# EAGLE schematic String Thing 1.0 (EAGLE 6.1)
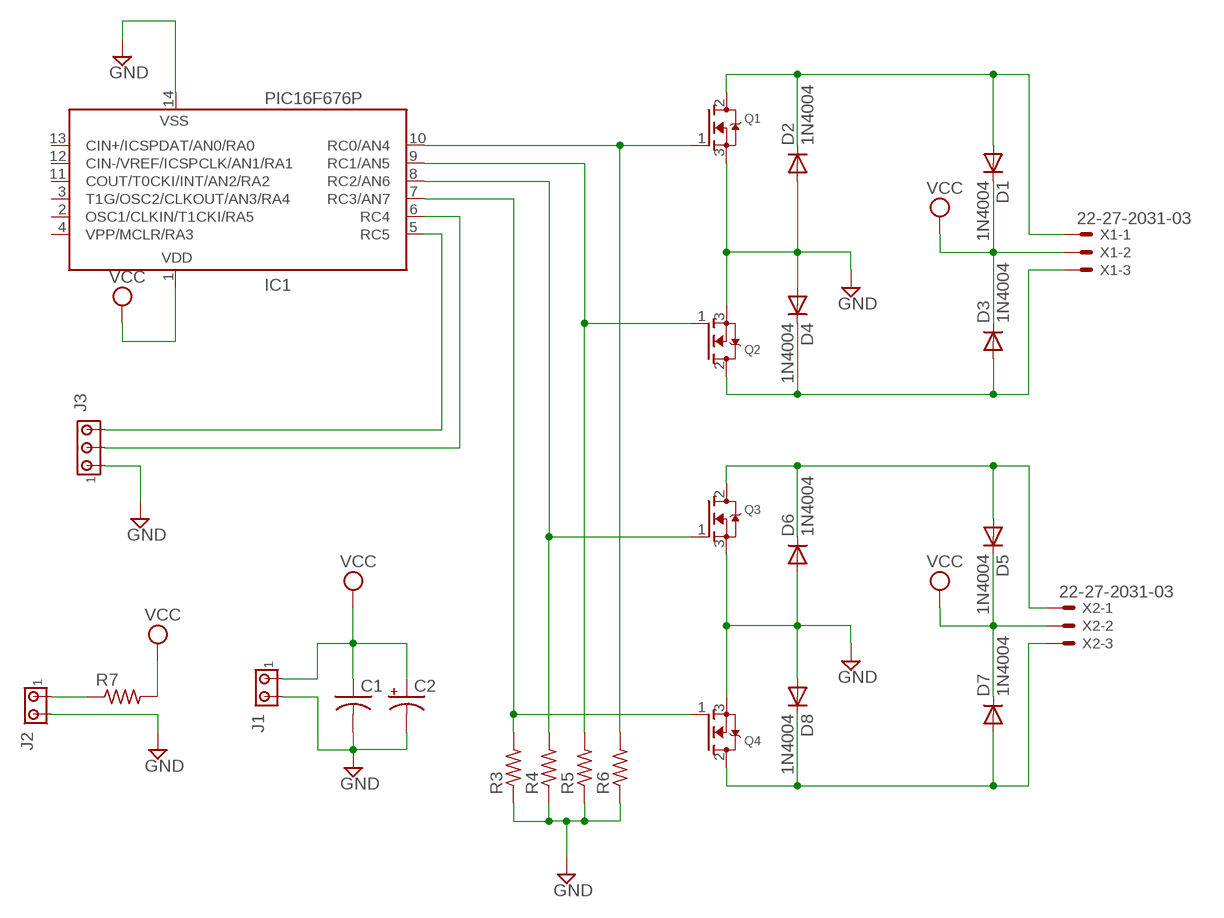
[diagram p0: schematic, sheet 1]

## Parts
C1  C-US025-025X050  [C025-025X050]
C2  CPOL-USE2.5-5  [E2,5-5]
D1  1N4004  [DO41-10]
D2  1N4004  [DO41-10]
D3  1N4004  [DO41-10]
D4  1N4004  [DO41-10]
D5  1N4004  [DO41-10]
D6  1N4004  [DO41-10]
D7  1N4004  [DO41-10]
D8  1N4004  [DO41-10]
IC1  PIC16F676P  [DIL14]
J1  MTA02-100  [10X02MTA]
J2  MTA02-100  [10X02MTA]
J3  MTA03-100  [10X03MTA]
Q1  MOSFET-NGDS_TO220V  [TO220V]
Q2  MOSFET-NGDS_TO220V  [TO220V]
Q3  MOSFET-NGDS_TO220V  [TO220V]
Q4  MOSFET-NGDS_TO220V  [TO220V]
R3  R-US_0207/10  [0207/10]
R4  R-US_0207/10  [0207/10]
R5  R-US_0207/10  [0207/10]
R6  R-US_0207/10  [0207/10]
R7  R-US_0207/10  [0207/10]
X1  22-27-2031-03  [6410-03]
X2  22-27-2031-03  [6410-03]

## Nets
GND: C1.2 C2.- D2.A D4.A D6.A D8.A IC1.14(VSS) J1.2 J2.2 J3.1 Q1.3(S) Q2.3(S) Q3.3(S) Q4.3(S) R3.1 R4.1 R5.1 R6.1
N$1: IC1.7(RC3/AN7) Q4.1(G) R3.2
N$2: IC1.8(RC2/AN6) Q3.1(G) R4.2
N$3: IC1.9(RC1/AN5) Q2.1(G) R5.2
N$4: IC1.10(RC0/AN4) Q1.1(G) R6.2
N$5: D1.A D2.C Q1.2(D) X1.1
N$6: D3.A D4.C Q2.2(D) X1.3
N$7: D5.A D6.C Q3.2(D) X2.1
N$8: D7.A D8.C Q4.2(D) X2.3
N$9: J2.1 R7.1
N$10: IC1.5(RC5) J3.3
N$11: IC1.6(RC4) J3.2
VCC: C1.1 C2.+ D1.C D3.C D5.C D7.C IC1.1(VDD) J1.1 R7.2 X1.2 X2.2
Unconnected: IC1.2(OSC1/CLKIN/T1CKI/RA5) IC1.3(T1G/OSC2/CLKOUT/AN3/RA4) IC1.4(VPP/MCLR/RA3) IC1.11(COUT/T0CKI/INT/AN2/RA2) IC1.12(CIN-/VREF/ICSPCLK/AN1/RA1) IC1.13(CIN+/ICSPDAT/AN0/RA0)

## Library data of the parts
C1 = adafruit:C-US: CAPACITOR, American symbol
C2 = adafruit:CPOL-US: POLARIZED CAPACITOR, American symbol
D1-D8 = diode:1N4004: DIODE general purpose rectifier, 1 A
IC1 = microchip:PIC16F676: 14-Pin, Flash-Based 8-Bit CMOS Microcontroller High Performance RISC CPU: * Only 35 instructions to learn - All single-cycle instructions except branches * Operating speed: - DC - 20 MHz oscillator/clock input - DC - 200 ns instruction cycle * Internal and external oscillator options - Precision Internal 4 MHz oscillator factory calibrated to ±1% - External Oscillator support for crystals and resonators - 5?s wake-up from SLEEP, 3.0V, typical * Power saving SLEEP mode * Wide operating voltage range - 2.0V to 5.5V * Industrial and Extended temperature range * Low power Power-on Reset (POR) * Power-up Timer (PWRT) and Oscillator Start-up Timer (OST) * Brown-out Detect (BOD) * Watchdog Timer (WDT) with independent oscillator for reliable operation * Multiplexed MCLR/Input-pin * Interrupt-on-pin change * Individual programmable weak pull-ups * Programmable code protection * High Endurance FLASH/EEPROM Cell - 100,000 write FLASH endurance - 1,000,000 write EEPROM endurance - FLASH/Data EEPROM Retention: > 40 years * Standby Current: - 1 nA @ 2.0V, typical * Operating Current: - 8.5?A @ 32 kHz, 2.0V, typical - 100?A @ 1 MHz, 2.0V, typical * Watchdog Timer Current - 300 nA @ 2.0V, typical * Timer1 oscillator current: - 4?A @ 32 kHz, 2.0V, typical * 12 I/O pins with individual direction control * High current sink/source for direct LED drive * Analog-to-Digital Converter module (PIC16F676): - 10-bit resolution - Programmable 8-channel input - Voltage reference input * In-Circuit Serial ProgrammingTM (ICSPTM) via two pins Source: http://ww1.microchip.com/downloads/en/DeviceDoc/40039E.pdf; MF: MICROCHIP; MPN: PIC16F676-I/P; OC_FARNELL: 9760512; OC_NEWARK: 54K2829
J1 J2 = con-amp:MTA02-100: AMP connector
J3 = con-amp:MTA03-100: AMP connector
Q1-Q4 = adafruit:MOSFET-N: N-Channel Mosfet 2N7002E - 60V 260mA SOT23 [Digikey: 2N7002ET1GOSTR-ND] - REEL BSH103 - 30V 850mA SOT23 [Digikey: 568-5013-1-ND]
R3-R7 = resistor:R-US_: RESISTOR, American symbol
X1 X2 = con-molex:22-?-03: CONNECTOR wire to board 2.54 mm (.1 inch) pitch header; OC_FARNELL: unknown; OC_NEWARK: unknown